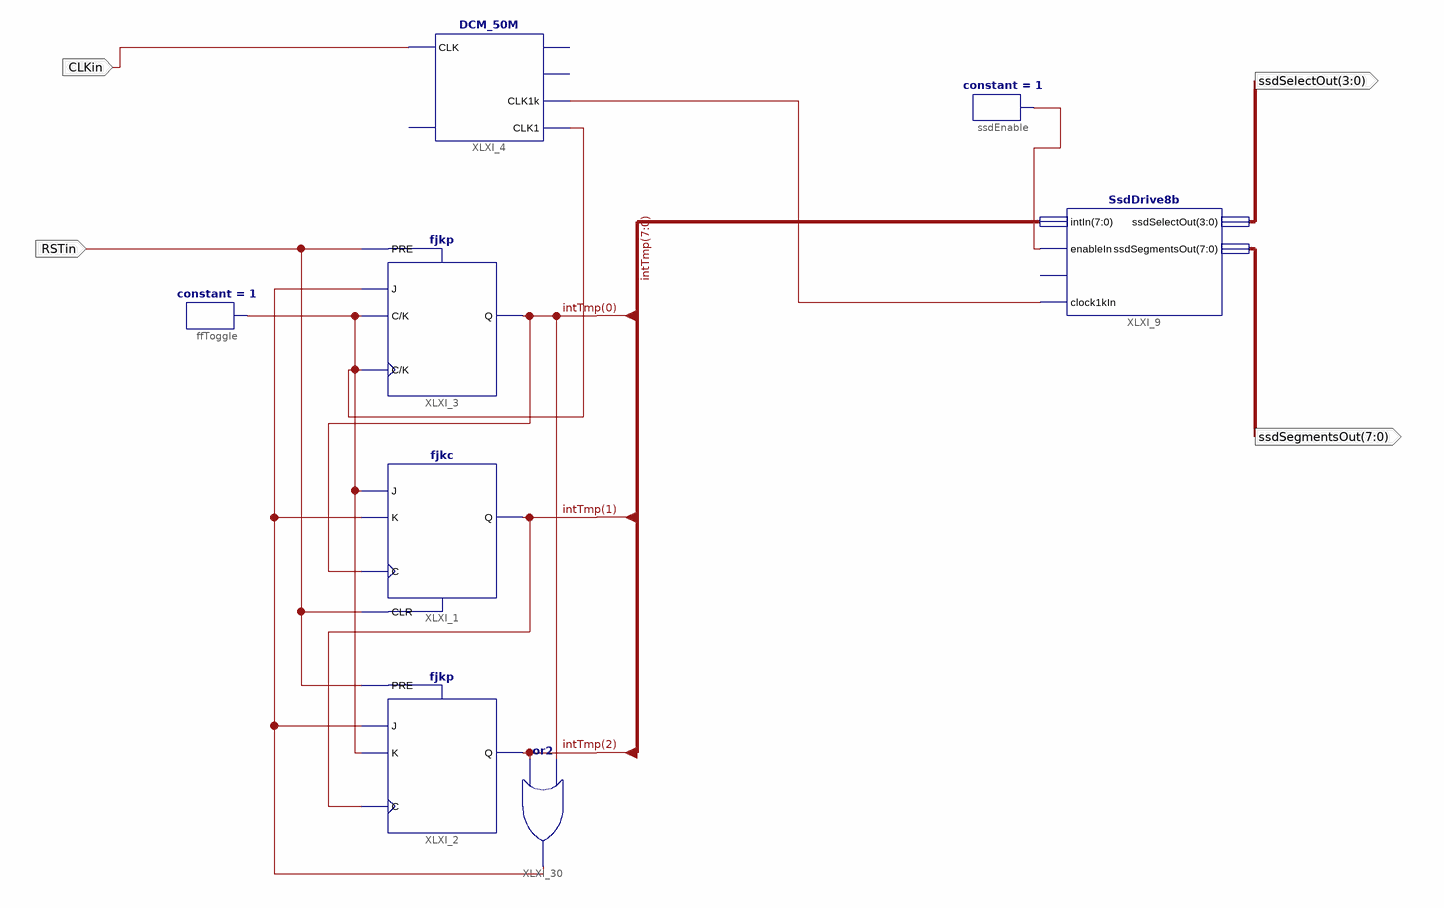
[diagram p0: schematic sheet 1]
// Xilinx ISE schematic Experiment4.sch (spartan3e) as structural Verilog: 8 symbols, 4 ports
module Experiment4 (
  input  RSTin,
  input  CLKin,
  output [3:0] ssdSelectOut,
  output [7:0] ssdSegmentsOut
);

  wire XLXN_2, XLXN_3, XLXN_58, XLXN_64;
  wire [7:0] intTmp;

  fjkp XLXI_3 (.C(XLXN_64), .J(XLXN_58), .K(XLXN_64), .PRE(RSTin), .Q(intTmp[0]));
  fjkc XLXI_1 (.C(intTmp[0]), .CLR(RSTin), .J(XLXN_64), .K(XLXN_58), .Q(intTmp[1]));
  fjkp XLXI_2 (.C(intTmp[1]), .J(XLXN_58), .K(XLXN_64), .PRE(RSTin), .Q(intTmp[2]));
  SsdDrive8b XLXI_9 (
    .intIn(intTmp), .enableIn(XLXN_3), .ssdSelectOut(ssdSelectOut), .ssdSegmentsOut(ssdSegmentsOut),
    .clock1kIn(XLXN_2));  // open: hexIn
  constant #(.CValue("1")) ssdEnable (.O(XLXN_3));
  or XLXI_30 (XLXN_58, intTmp[2], intTmp[0]);
  DCM_50M XLXI_4 (.CLK(CLKin), .CLK1k(XLXN_2), .CLK1(XLXN_64));  // open: RST, CLK1M, CLK10k
  constant #(.CValue("1")) ffToggle (.O(XLXN_64));
endmodule
